# Altium schematic sheet FUNCTION_BUTTONS.SchDoc
size A; SheetNumber: 4; SheetTotal: 4
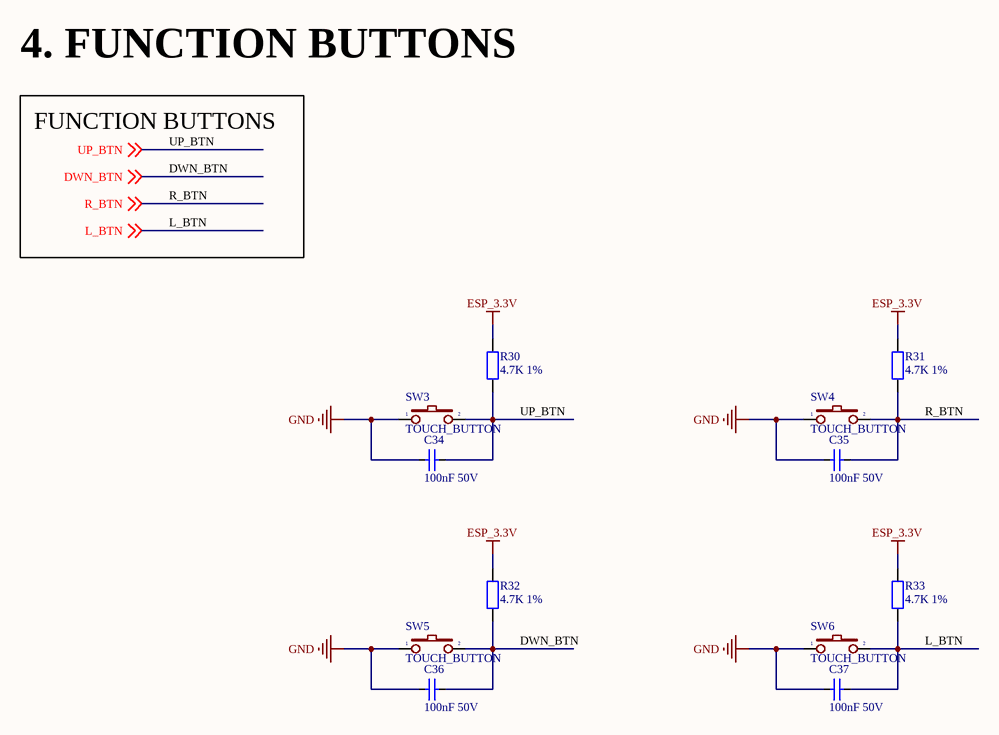
[diagram p0: FUNCTION_BUTTONS.SchDoc]

## Parts
C34  100nF 50V  [CAP_SMD_0603]
C35  100nF 50V  [CAP_SMD_0603]
C36  100nF 50V  [CAP_SMD_0603]
C37  100nF 50V  [CAP_SMD_0603]
R30  4.7K 1%  [RES_SMD_0603]
R31  4.7K 1%  [RES_SMD_0603]
R32  4.7K 1%  [RES_SMD_0603]
R33  4.7K 1%  [RES_SMD_0603]
SW3  TOUCH_BUTTON  [TOUCH_BUTTON]
SW4  TOUCH_BUTTON  [TOUCH_BUTTON]
SW5  TOUCH_BUTTON  [TOUCH_BUTTON]
SW6  TOUCH_BUTTON  [TOUCH_BUTTON]

## Nets
ESP_3.3V: R30.2 R31.2 R32.2 R33.2
GND: C34.1 C35.1 C36.1 C37.1 SW3.1 SW4.1 SW5.1 SW6.1
DWN_BTN: C36.2 R32.1 SW5.2 ; off-sheet DWN_BTN
L_BTN: C37.2 R33.1 SW6.2 ; off-sheet L_BTN
R_BTN: C35.2 R31.1 SW4.2 ; off-sheet R_BTN
UP_BTN: C34.2 R30.1 SW3.2 ; off-sheet UP_BTN

## Notes on the sheet
- 4. FUNCTION BUTTONS
- FUNCTION BUTTONS

## Library data of the parts
C34-C37 = C0603_MLCC_100nF_50V: 0.1 µF ±10% 50V Ceramic Capacitor X7R 0603 (1608 Metric); Manufacturer: Samsung Electro-Mechanics; Manufacture Part Number: CL10B104KB8NNNC; Packaging: Cut Tape (CT); Link: https://www.digikey.cn/en/products/detail/samsung-electro-mechanics/CL10B104KB8NNNC/3886658; Price: $0.10; Size: 0603
R30-R33 = R0603_4.7K: 4.7 kOhms ±1% 0.1W, 1/10W Chip Resistor 0603 (1608 Metric) Moisture Resistant Thick Film; Manufacturer: YAGEO; Manufacture Part Number: RC0603FR-074K7L; Packaging: Cut Tape (CT); Link: https://www.digikey.com/en/products/detail/yageo/RC0603FR-074K7L/727212; Price: $0.10; Size: 0603